# Altium schematic sheet PAGE1.SCHDOC: 916 MHZ Super Hetrodyne Receiver
size B; DocumentNumber: Page Create Date; Revision: 3; SheetNumber: 1; SheetTotal: 3
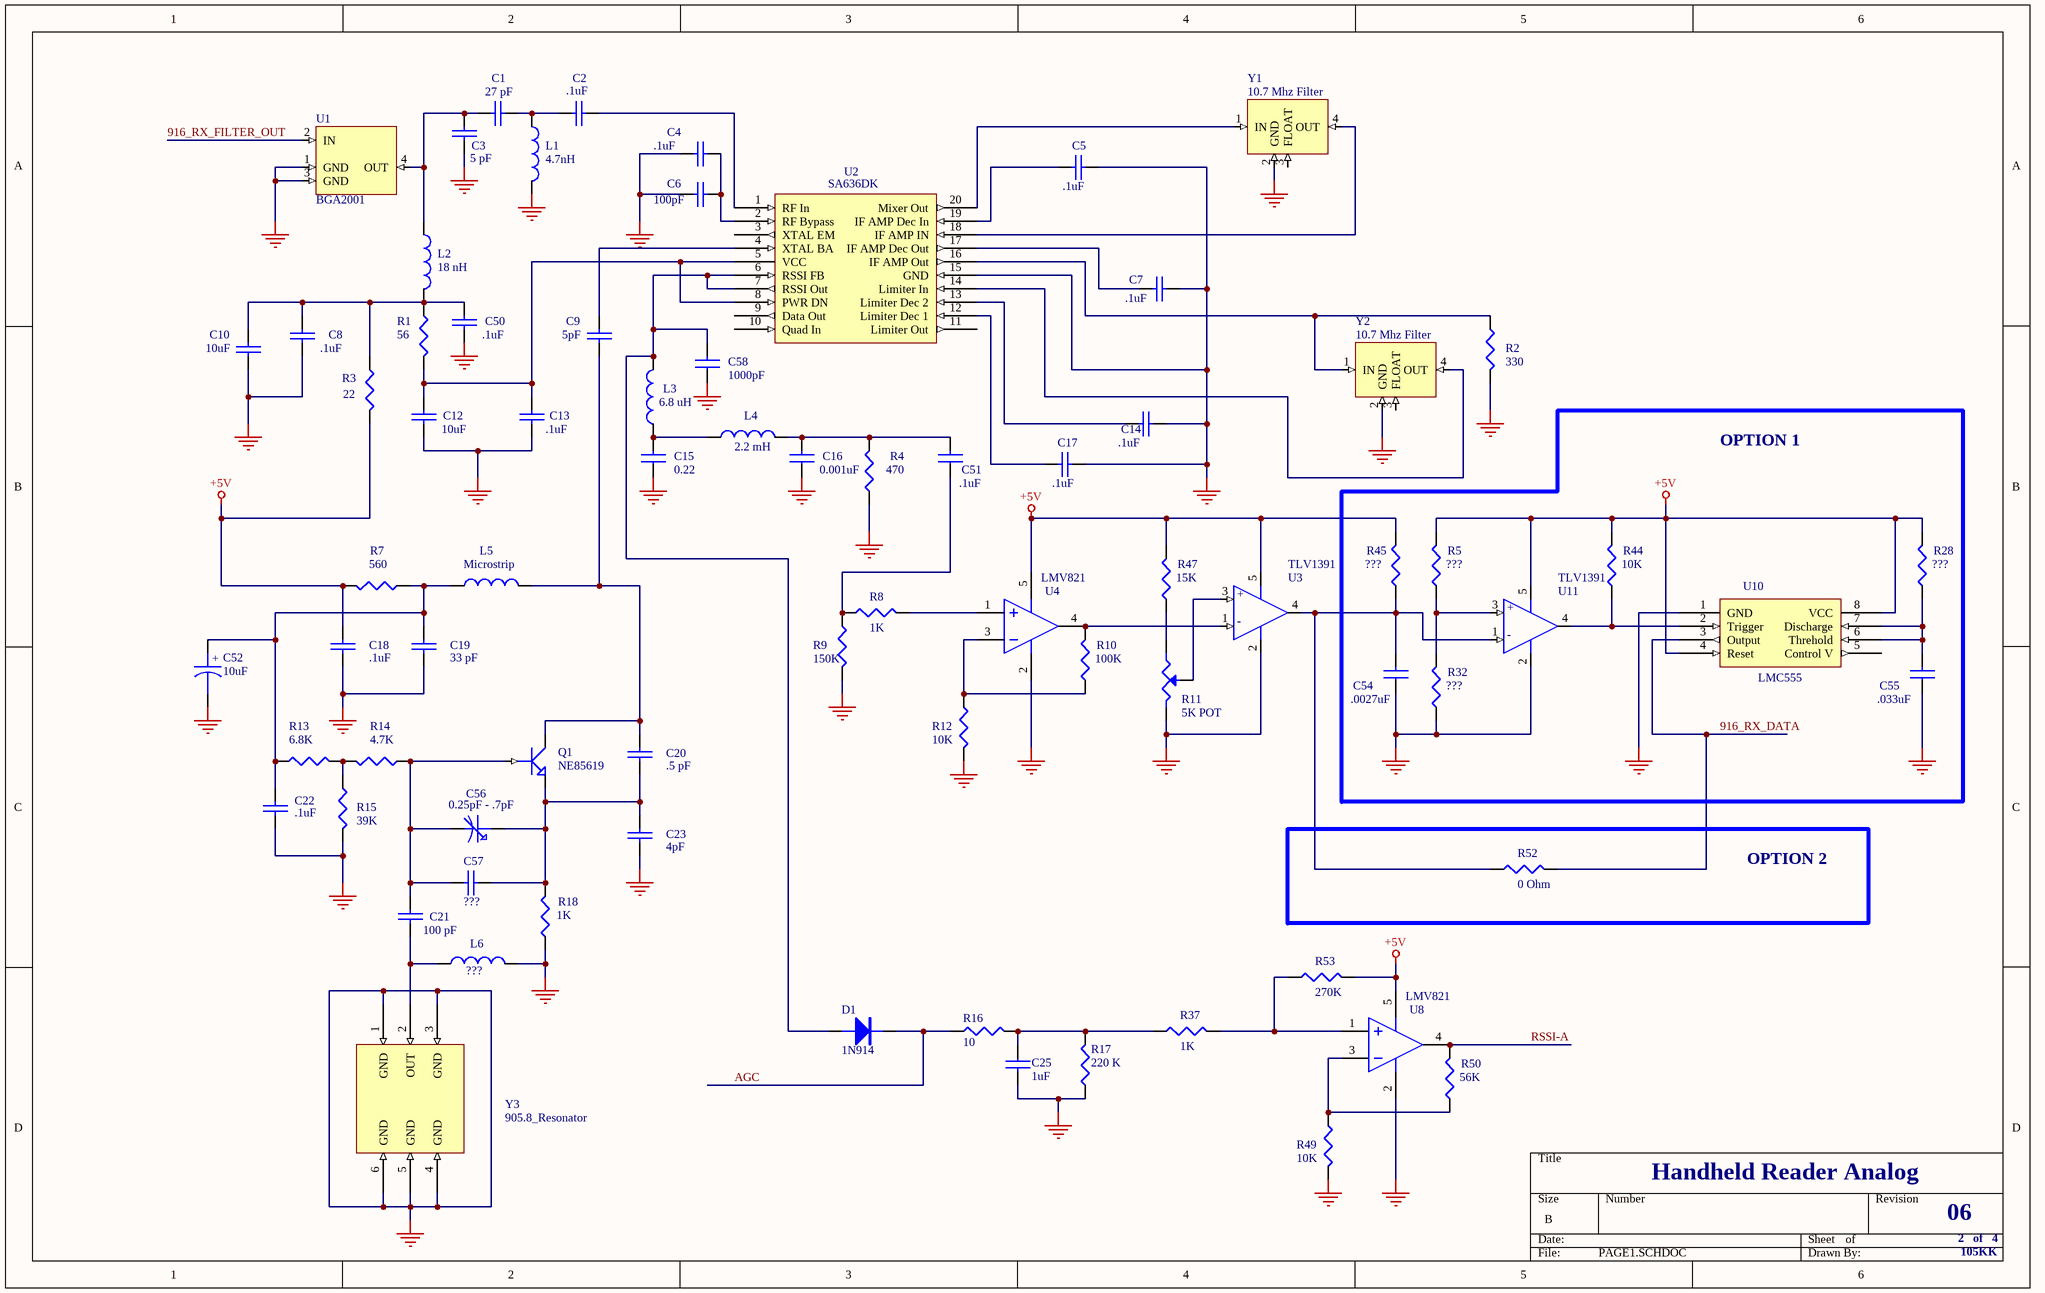
[diagram p0: PAGE1.SCHDOC]

## Parts
C1  27 pF  [0603]
C2  .1uF  [0603]
C3  5 pF  [0603]
C4  .1uF  [0603]
C5  .1uF  [0603]
C6  100pF  [0603]
C7  .1uF  [0603]
C8  .1uF  [0603]
C9  5pF  [0603]
C10  10uF  [CAP A CASE]
C12  10uF  [CAP A CASE]
C13  .1uF  [0603]
C14  .1uF  [0603]
C15  0.22  [0603]
C16  0.001uF  [0603]
C17  .1uF  [0603]
C18  .1uF  [0603]
C19  33 pF  [0603]
C20  .5 pF  [0603]
C21  100 pF  [0603]
C22  .1uF  [0603]
C23  4pF  [0603]
C25  1uF  [CAP A CASE]
C50  .1uF  [0603]
C51  .1uF  [0603]
C52  10uF  [CAP A CASE]
C54  .0027uF  [0603]
C55  .033uF  [0805]
C56  0.25pF - .7pF  [CAP TRIMMER JOHANSON]
C57  ???  [0603]
C58  1000pF  [0603]
D1  1N914  [SOT23 DIODE]
L1  4.7nH  [0603]
L2  18 nH  [0603]
L3  6.8 uH  [0805]
L4  2.2 mH  [COIL TKS5540CT-ND]
L5  Microstrip  [MICROSTRIP]
L6  ???  [0603]
Q1  NE85619  [3 PIN ULTRA SUPER MINI MOLD]
R1  56  [0603]
R2  330  [0603]
R3  22  [0603]
R4  470  [0603]
R5  ???  [0603]
R7  560  [0603]
R8  1K  [0603]
R9  150K  [0603]
R10  100K  [0603]
R11  5K POT  [POT PANA EVN5]
R12  10K  [0603]
R13  6.8K  [0603]
R14  4.7K  [0603]
R15  39K  [0603]
R16  10  [0603]
R17  220 K  [0603]
R18  1K  [0603]
R28  ???  [0603]
R32  ???  [0603]
R37  1K  [0603]
R44  10K  [0603]
R45  ???  [0603]
R47  15K  [0603]
R49  10K  [0603]
R50  56K  [0603]
R52  0 Ohm  [0603]
R53  270K  [0603]
U1  BGA2001  [SOT343]
U2  SA636DK  [SSOP20]
U3  TLV1391  [SOT25]
U4  LMV821  [SOT25]
U8  LMV821  [SOT25]
U10  LMC555  [SO8 SMALL]
U11  TLV1391  [SOT25]
Y1  10.7 Mhz Filter  [FILTER2]
Y2  10.7 Mhz Filter  [FILTER2]
Y3  905.8_Resonator  [RESONATOR2]

## Blocks framed on the sheet
OPTION 1: C54 C55 R5 R28 R32 R44 R45 U10 U11
OPTION 2: R52

## Nets
+5V: C18.1 R3.2 R5.2 R7.2 R28.2 R44.2 R45.2 R47.2 R53.2 U3.5(VDD) U4.5 U8.5 U10.4(Reset) U10.8(VCC) U11.5(VDD)
GND_SIGNAL: C3.2 C4.1 C5.2 C6.1 C7.2 C8.2 C10.2 C12.2 C13.2 C14.2 C15.1 C16.1 C17.2 C18.2 C19.2 C22.2 C23.2 C25.2 C50.2 C52.2 C54.1 C55.1 C58.1 L1.2 L6.2 R2.2 R4.1 R9.2 R11.3 R12.2 R15.2 R17.2 R18.1 R32.1 R49.2 U1.1(GND) U1.3(GND) U2.15(GND) U3.2(VSS) U4.2 U8.2 U10.1(GND) U11.2(VSS) Y1.2(GND) Y2.2(GND) Y3.1(GND) Y3.3(GND) Y3.4(GND) Y3.5(GND) Y3.6(GND)
916_RX_DATA: R52.2 U10.3(Output)
916_RX_FILTER_OUT: U1.2(IN)
AGC: D1.K R16.2
RSSI-A: R50.2 U8.4
NetC1_1: C1.1 C3.1 L2.1 U1.4(OUT)
NetC1_2: C1.2 C2.1 L1.1
NetC2_2: C2.2 U2.1(RF_In)
NetC4_2: C4.2 C6.2 U2.2(RF_Bypass)
NetC5_1: C5.1 U2.19(IF_AMP_Dec_In)
NetC7_1: C7.1 U2.17(IF_AMP_Dec_Out)
NetC8_1: C8.1 C10.1 C50.1 L2.2 R1.1 R3.1
NetC9_1: C9.1 C20.1 L5.2 Q1.C
NetC9_2: C9.2 U2.4(XTAL_BA)
NetC12_1: C12.1 C13.1 R1.2 U2.5(VCC) U2.8(PWR_DN)
NetC14_1: C14.1 U2.13(Limiter_Dec_2)
NetC15_2: C15.2 L3.1 L4.1
NetC16_2: C16.2 C51.2 L4.2 R4.2
NetC17_1: C17.1 U2.12(Limiter_Dec_1)
NetC19_1: C19.1 C22.1 C52.1 L5.1 R7.1 R13.1
NetC20_2: C20.2 C23.1 C56.1 C57.2 Q1.E R18.2
NetC21_1: C21.1 C56.2 C57.1 Q1.B R14.1
NetC21_2: C21.2 L6.1 Y3.2(OUT)
NetC25_1: C25.1 R16.1 R17.1 R37.1
NetC51_1: C51.1 R8.1 R9.1
NetC54_2: C54.2 R45.1 R52.1 U3.4(OUT) U11.1(-)
NetC55_2: C55.2 R28.1 U10.6(Threhold) U10.7(Discharge)
NetC58_2: C58.2 D1.A L3.2 U2.6(RSSI_FB) U2.7(RSSI_Out)
NetR2_1: R2.1 U2.16(IF_AMP_Out) Y2.1(IN)
NetR5_1: R5.1 R32.2 U11.3(+)
NetR8_2: R8.2 U4.1
NetR10_1: R10.1 R12.1 U4.3
NetR10_2: R10.2 U3.1(-) U4.4
NetR11_1: R11.1 R47.1
NetR11_2: R11.2 U3.3(+)
NetR13_2: R13.2 R14.2 R15.1
NetR37_2: R37.2 R53.1 U8.1
NetR44_1: R44.1 U10.2(Trigger) U11.4(OUT)
NetR49_1: R49.1 R50.1 U8.3
NetU2_14: U2.14(Limiter_In) Y2.4(OUT)
NetU2_18: U2.18(IF_AMP_IN) Y1.4(OUT)
NetU2_20: U2.20(Mixer_Out) Y1.1(IN)

Not connected (* = marked no-connect by the designer): U2 3(XTAL_EM) 9(Data_Out) 10(Quad_In) 11(Limiter_Out); U10 5(Control_V); Y1 3(FLOAT); Y2 3(FLOAT)

## Notes on the sheet
- Handheld Reader Analog
- 06
- 2   of   4
- 105KK
- (in symbol CAPACITOR POL) +

## Library data of the parts
C1-C10 C12-C14 C17-C23 C50 C57 = CAP: Capacitor
C15 C16 C25 C51 C54 C55 C58 = CAP_NP: Text Field1: 20; Text Field2: 10
C52 = CAPACITOR POL: Capacitor
C56 = CAPACITOR VAR: Text Field1: 20; Text Field2: 20
D1 = DIODE
L1-L6 = INDUCTOR: Text Field1: 20; Text Field2: 40
Q1 = NPN1: NPN Transistor
R1-R5 R8-R10 R12 R16 R17 R28 R32 R37 R44 R45 R47 R49 R50 R52 R53 = R: Text Field1: 20; Text Field2: 30
R7 R13-R15 R18 = RESISTOR: Text Field1: 20; Text Field2: 30
R11 = POT1: Potentiometer
U2 = SA636DK: Text Field1: 120; Text Field2: 110
U3 U11 = TLV1391: Text Field1: 40; Text Field2: 40
U4 U8 = OPAMP1
U10 = LMC555: Text Field1: 90; Text Field2: 50
Y1 Y2 = FILTER2
Y3 = RESONATOR2